# Altium schematic sheet Outputs.SchDoc: Outputs
size 297 x 209 mm; DocumentNumber: SP-0335; SheetNumber: 5; SheetTotal: 5
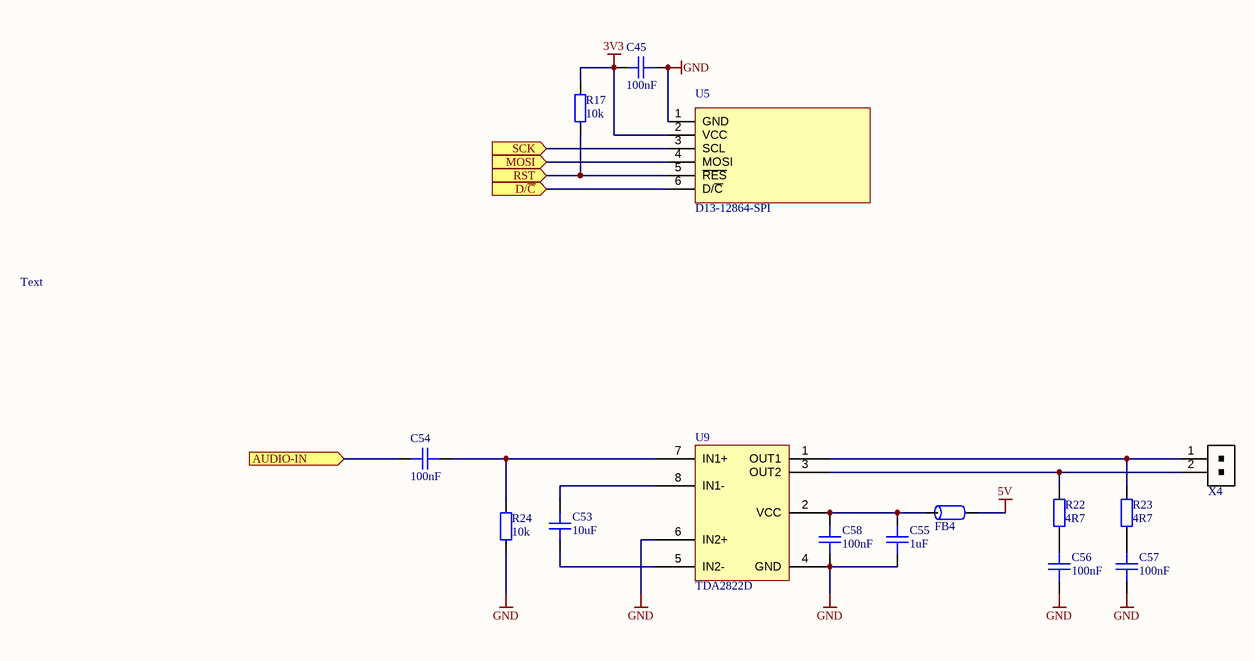
[diagram p0: Outputs.SchDoc]

## Parts
C45  100nF  [CAP-0603]
C53  10uF  [CAP-0805]
C54  100nF  [CAP-0603]
C55  1uF  [CAP-0805]
C56  100nF  [CAP-0603]
C57  100nF  [CAP-0603]
C58  100nF  [CAP-0603]
FB4  FB - 0603  [FB-0603]  (value not drawn)
R17  10k  [RES-0603]
R22  4R7  [RES-0603]
R23  4R7  [RES-0603]
R24  10k  [RES-0603]
U5  D13-12864-SPI  [MISC-OLED DISPLAY-128x64]
U9  TDA2822D  [IC-SOIC-8]
X4  CONN - 2P -THT-JST 2.00mm  [CONN-2P-THT-RIGHT-JST 2.00mm]  (value not drawn)

## Ports
AUDIO-IN (in), D/~{C} (in), MOSI (in), RST (in), SCK (in)

## Nets
3V3: C45.2 R17.2 U5.2(VCC)
5V: FB4.2
GND: C45.1 C55.1 C56.2 C57.2 C58.1 R24.1 U5.1(GND) U9.4(GND) U9.6(IN2+)
AUDIO-IN: C54.1 ; port AUDIO-IN
D/~{C}: U5.6(D/~{C}) ; port D/~{C}
MOSI: U5.4(MOSI) ; port MOSI
RST: R17.1 U5.5(~{RES}) ; port RST
SCK: U5.3(SCL) ; port SCK
NetC53_1: C53.1 U9.5(IN2-)
NetC53_2: C53.2 U9.8(IN1-)
NetC54_2: C54.2 R24.2 U9.7(IN1+)
NetC55_2: C55.2 C58.2 FB4.1 U9.2(VCC)
NetC56_1: C56.1 R22.1
NetC57_1: C57.1 R23.1
NetR22_2: R22.2 U9.3(OUT2) X4.2
NetR23_2: R23.2 U9.1(OUT1) X4.1

## Notes on the sheet
- Text
- PROJECT NAME
- DATE
- TITLE
- TIME
- VERSION CONTROL
- N/A
- SIZE
- SCALE:
- A4
- FILE NAME
- DWG NO.
- SHEET
- REV
- OF
- DRAWN BY:

## Library data of the parts
C45 C54 C56-C58 = CAP - 0603: Capacitor Non-Polar; Value: 100nF; Distributor: *; Order number: *
C53 C55 = CAP - 0805: Capacitor Non-Polar; Distributor: *; Order number: *
  C53: Value: 10uF
  C55: Value: 1uF
FB4 = FB - 0603: Ferrit bead 0603; Distributor: Lomex; Order Number: *
R17 R22-R24 = RES - 0603: Resistor; Distributor: *; Order number: *
  R17 R24: Value: 10k
  R22 R23: Value: 4R7
U5 = MISC - D13-12864-SPI: 1.3in 128x64 OLED, SPI interface, SH1106; Order number: 100.356.08; ComponentLink1Description: DataSheet; Distributor: Hestore
U9 = IC - TDA2822: DUAL LOW-VOLTAGE POWER AMPLIFIER, 1W, 4-32 Ohm; Order number: 100.463.57; Distributor: Hestore; Supplier 1: RS; Supplier Part Number 1: 426162P
X4 = CONN - 2P -THT-JST 2.00mm: 1x2 pin THT connector; Order number: 100.385.23; 100.341.10; Distributor: Hestore